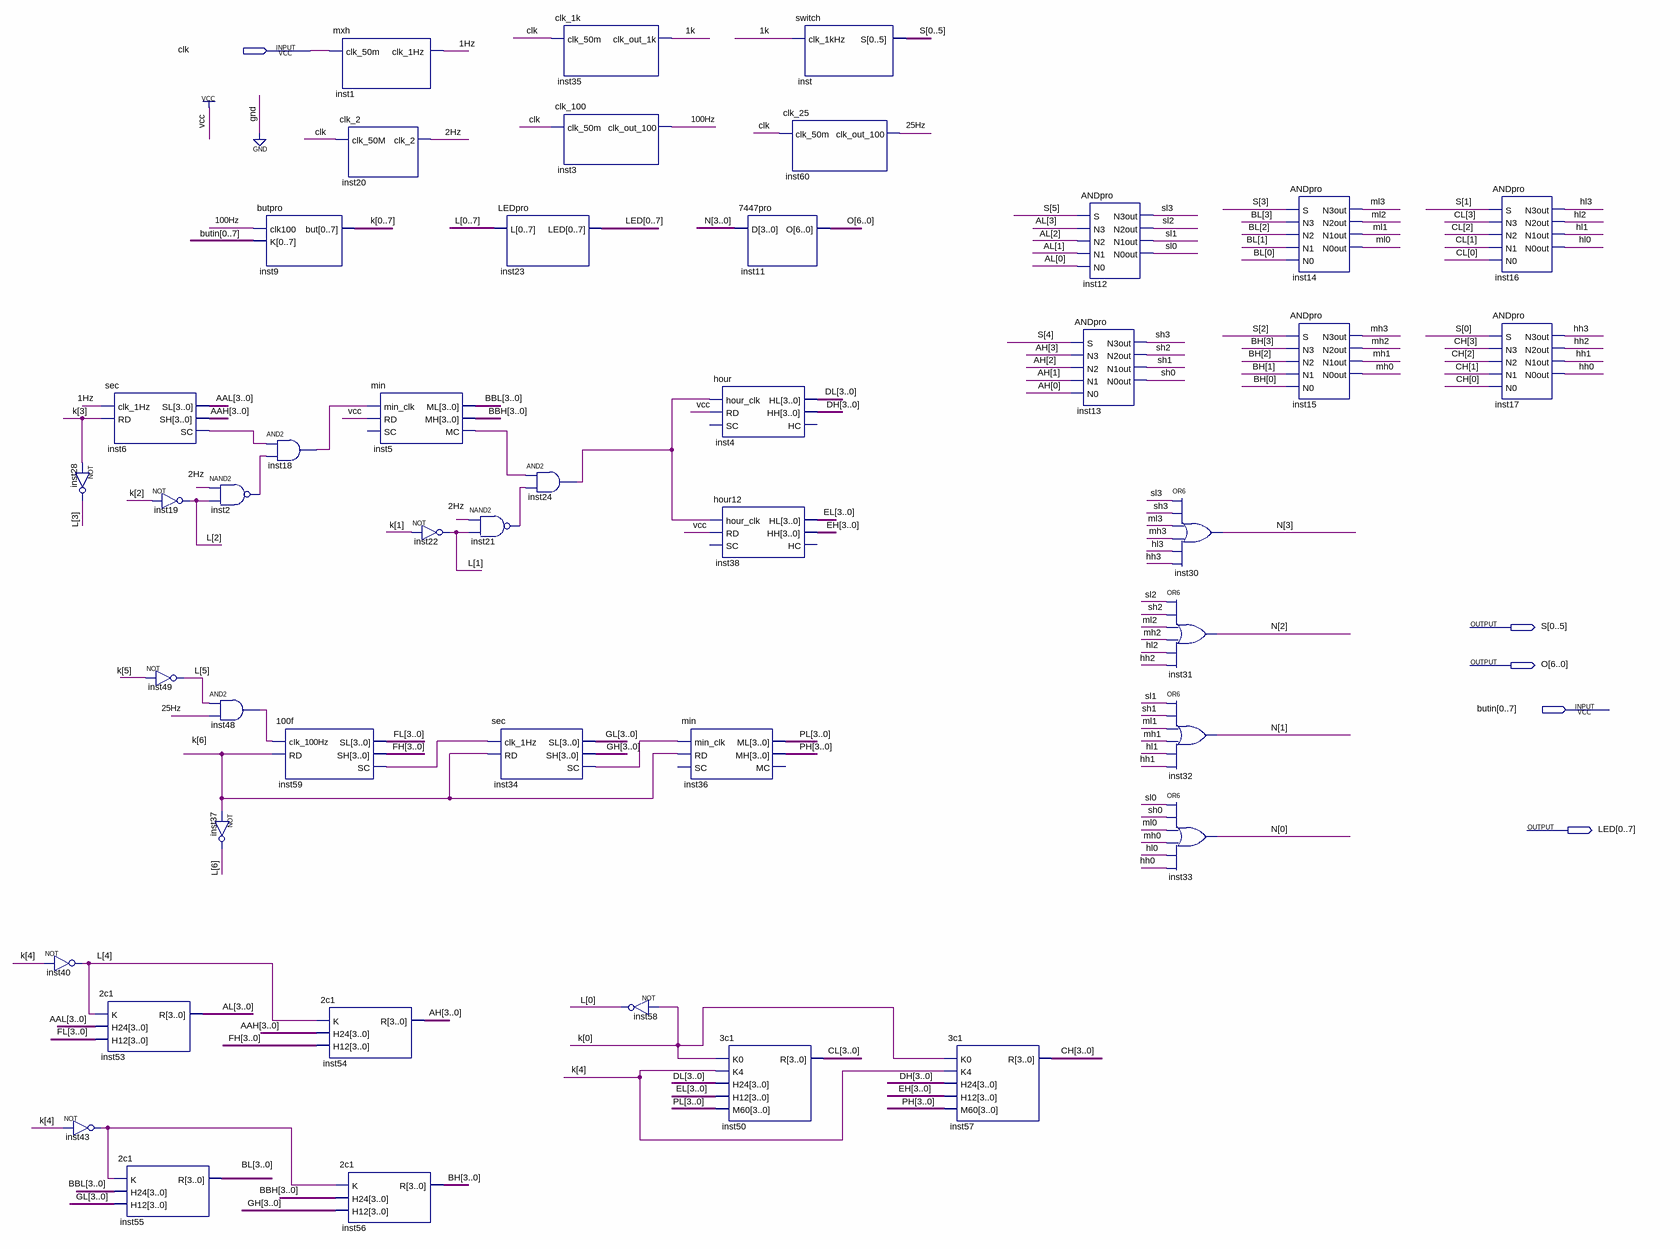
[diagram p0: schematic sheet]
// Quartus schematic clock24.bdf as structural Verilog: 45 symbols, 5 pins
module clock24 (
  input  clk,
  input  [0:7] butin,
  output [0:5] S,
  output [6:0] O,
  output [0:7] LED
);

  wire \1Hz , \1k , \2Hz , \25Hz , \100Hz , hh0, hh1, hh2, hh3, hl0, hl1, hl2, hl3, inst2_out, inst5_mc,
       inst6_sc, inst18_out, inst21_out, inst24_out, inst34_sc, inst43_out, inst48_out, inst59_sc, mh0, mh1,
       mh2, mh3, ml0, ml1, ml2, ml3, sh0, sh1, sh2, sh3, sl0, sl1, sl2, sl3;
  wire [3:0] AAH, AAL, AH, AL, BBH, BBL, BH, BL, CH, CL, DH, DL, EH, EL, FH, FL, GH, GL, N, PH, PL;
  wire [7:0] k, L;

  not inst28 (L[3], k[3]);
  not inst40 (L[4], k[4]);
  not inst43 (inst43_out, k[4]);
  sec inst6 (.clk_1Hz(\1Hz ), .RD(k[3]), .SL(AAL), .SH(AAH), .SC(inst6_sc));
  \2c1  inst53 (.K(L[4]), .H24(AAL), .H12(FL), .R(AL));
  \2c1  inst55 (.K(inst43_out), .H24(BBL), .H12(GL), .R(BL));
  not inst19 (L[2], k[2]);
  not inst49 (L[5], k[5]);
  nand inst2 (inst2_out, \2Hz , L[2]);
  and inst48 (inst48_out, L[5], \25Hz );
  not inst37 (L[6], k[6]);
  butpro inst9 (.clk100(\100Hz ), .K(butin), .but({k[0], k[1], k[2], k[3], k[4], k[5], k[6], k[7]}));
  and inst18 (inst18_out, inst6_sc, inst2_out);
  \100f  inst59 (.clk_100Hz(inst48_out), .RD(k[6]), .SL(FL), .SH(FH), .SC(inst59_sc));
  mxh inst1 (.clk_50m(clk), .clk_1Hz(\1Hz ));
  \2c1  inst54 (.K(L[4]), .H24(AAH), .H12(FH), .R(AH));
  clk_2 inst20 (.clk_50M(clk), .clk_2(\2Hz ));
  min inst5 (.min_clk(inst18_out), .RD(1'b1), .ML(BBL), .MH(BBH), .MC(inst5_mc));  // open: SC
  \2c1  inst56 (.K(inst43_out), .H24(BBH), .H12(GH), .R(BH));
  not inst22 (L[1], k[1]);
  nand inst21 (inst21_out, \2Hz , L[1]);
  LEDpro inst23 (.L({L[0], L[1], L[2], L[3], L[4], L[5], L[6], L[7]}), .LED(LED));
  and inst24 (inst24_out, inst5_mc, inst21_out);
  sec inst34 (.clk_1Hz(inst59_sc), .RD(k[6]), .SL(GL), .SH(GH), .SC(inst34_sc));
  clk_1k inst35 (.clk_50m(clk), .clk_out_1k(\1k ));
  clk_100 inst3 (.clk_50m(clk), .clk_out_100(\100Hz ));
  not inst58 (L[0], k[0]);
  min inst36 (.min_clk(inst34_sc), .RD(k[6]), .ML(PL), .MH(PH));  // open: SC, MC
  \7447pro  inst11 (.D(N), .O(O));
  hour inst4 (.hour_clk(inst24_out), .RD(1'b1), .HL(DL), .HH(DH));  // open: SC, HC
  hour12 inst38 (.hour_clk(inst24_out), .RD(1'b1), .HL(EL), .HH(EH));  // open: SC, HC
  \3c1  inst50 (.K0(k[0]), .K4(k[4]), .H24(DL), .H12(EL), .M60(PL), .R(CL));
  clk_25 inst60 (.clk_50m(clk), .clk_out_100(\25Hz ));
  switch inst (.clk_1kHz(\1k ), .S(S));
  \3c1  inst57 (.K0(k[0]), .K4(k[4]), .H24(DH), .H12(EH), .M60(PH), .R(CH));
  ANDpro inst12 (
    .S(S[5]), .N3(AL[3]), .N2(AL[2]), .N1(AL[1]), .N0(AL[0]), .N3out(sl3), .N2out(sl2), .N1out(sl1),
    .N0out(sl0));
  ANDpro inst13 (
    .S(S[4]), .N3(AH[3]), .N2(AH[2]), .N1(AH[1]), .N0(AH[0]), .N3out(sh3), .N2out(sh2), .N1out(sh1),
    .N0out(sh0));
  or inst30 (N[3], sl3, sh3, ml3, mh3, hl3, hh3);
  or inst31 (N[2], sl2, sh2, ml2, mh2, hl2, hh2);
  or inst32 (N[1], sl1, sh1, ml1, mh1, hl1, hh1);
  or inst33 (N[0], sl0, sh0, ml0, mh0, hl0, hh0);
  ANDpro inst14 (
    .S(S[3]), .N3(BL[3]), .N2(BL[2]), .N1(BL[1]), .N0(BL[0]), .N3out(ml3), .N2out(ml2), .N1out(ml1),
    .N0out(ml0));
  ANDpro inst15 (
    .S(S[2]), .N3(BH[3]), .N2(BH[2]), .N1(BH[1]), .N0(BH[0]), .N3out(mh3), .N2out(mh2), .N1out(mh1),
    .N0out(mh0));
  ANDpro inst16 (
    .S(S[1]), .N3(CL[3]), .N2(CL[2]), .N1(CL[1]), .N0(CL[0]), .N3out(hl3), .N2out(hl2), .N1out(hl1),
    .N0out(hl0));
  ANDpro inst17 (
    .S(S[0]), .N3(CH[3]), .N2(CH[2]), .N1(CH[1]), .N0(CH[0]), .N3out(hh3), .N2out(hh2), .N1out(hh1),
    .N0out(hh0));
endmodule
